# Altium schematic sheet MARS_GPIO_MISC.SchDoc: My title
size A3; Organization: University of California; Address1: 475 Portola Plaza; Address2: Los Angeles, CA 90095; Revision: R01; SheetNumber: 1; SheetTotal: 1
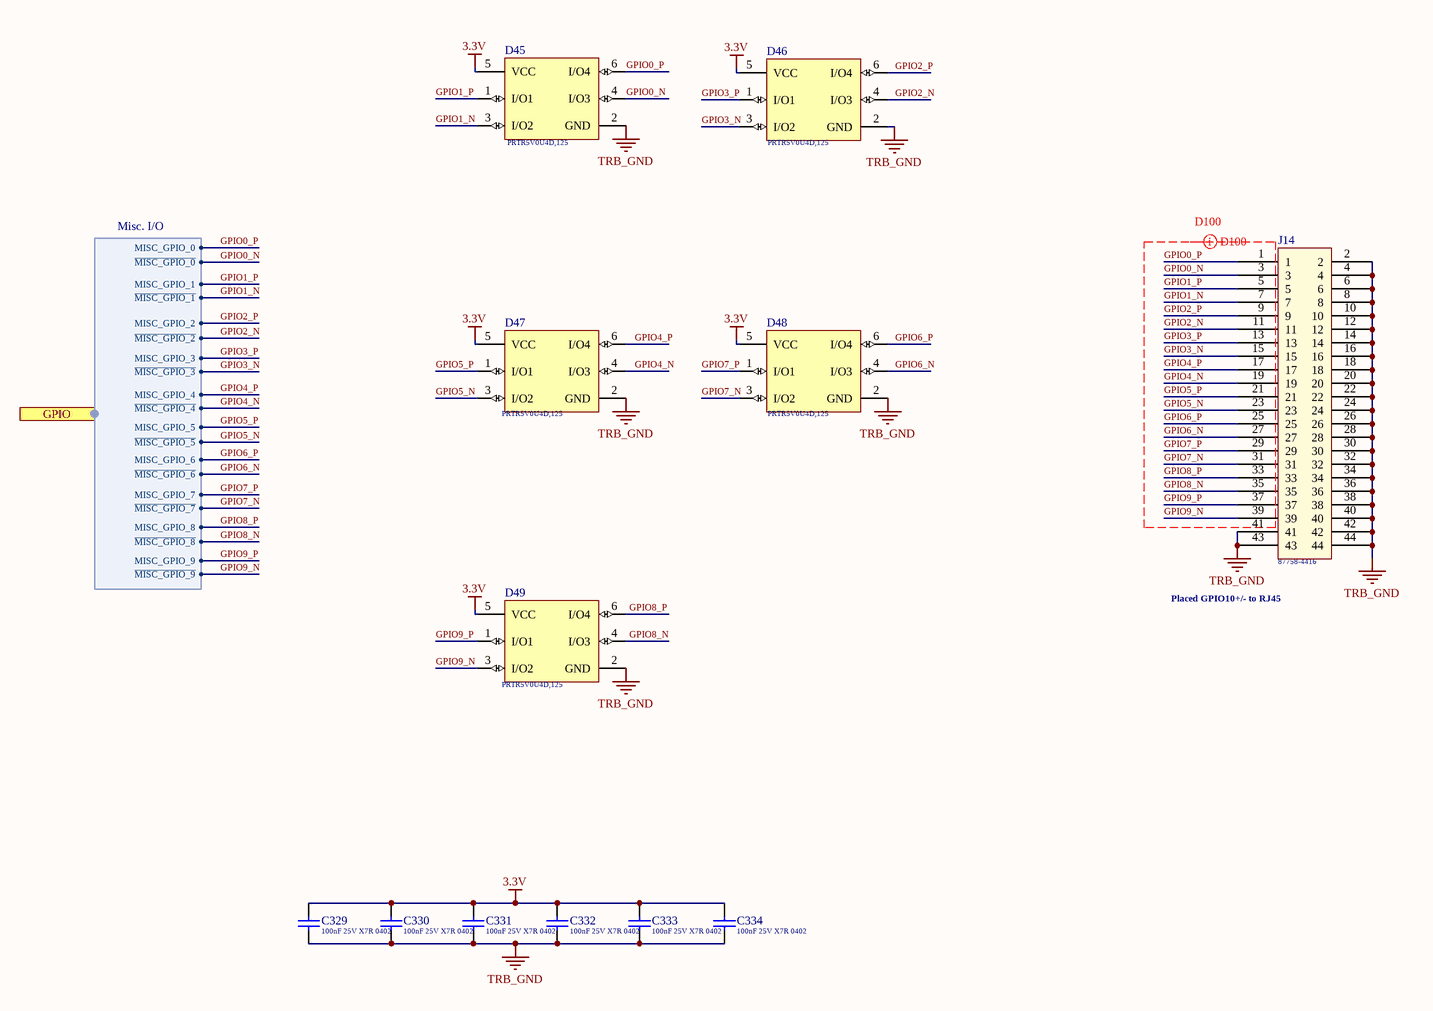
[diagram p0: MARS_GPIO_MISC.SchDoc]

## Parts
C329  Capacitance: 100nF 25V X7R 0402  [Cap_Taiyo_Yuden_TMK105B7104KV-FR_100nF]  (hidden comment: Cap_Taiyo_Yuden_TMK105B7104KV-FR_100nF)
C330  Capacitance: 100nF 25V X7R 0402  [Cap_Taiyo_Yuden_TMK105B7104KV-FR_100nF]  (hidden comment: Cap_Taiyo_Yuden_TMK105B7104KV-FR_100nF)
C331  Capacitance: 100nF 25V X7R 0402  [Cap_Taiyo_Yuden_TMK105B7104KV-FR_100nF]  (hidden comment: Cap_Taiyo_Yuden_TMK105B7104KV-FR_100nF)
C332  Capacitance: 100nF 25V X7R 0402  [Cap_Taiyo_Yuden_TMK105B7104KV-FR_100nF]  (hidden comment: Cap_Taiyo_Yuden_TMK105B7104KV-FR_100nF)
C333  Capacitance: 100nF 25V X7R 0402  [Cap_Taiyo_Yuden_TMK105B7104KV-FR_100nF]  (hidden comment: Cap_Taiyo_Yuden_TMK105B7104KV-FR_100nF)
C334  Capacitance: 100nF 25V X7R 0402  [Cap_Taiyo_Yuden_TMK105B7104KV-FR_100nF]  (hidden comment: Cap_Taiyo_Yuden_TMK105B7104KV-FR_100nF)
D45  PRTR5V0U4D,125  [PRTR5V0U4D,125]
D46  PRTR5V0U4D,125  [PRTR5V0U4D,125]
D47  PRTR5V0U4D,125  [PRTR5V0U4D,125]
D48  PRTR5V0U4D,125  [PRTR5V0U4D,125]
D49  PRTR5V0U4D,125  [PRTR5V0U4D,125]
J14  Series: 87758-4416  [Header_Molex_87758-4416_44POS]  (hidden comment: Header_Molex_87758-4416_44POS)

## Ports
GPIO (harness Misc. I/O)

## Harnesses
Misc. I/O: MISC_GPIO_0, ~{MISC_GPIO_0}, MISC_GPIO_1, ~{MISC_GPIO_1}, MISC_GPIO_2, ~{MISC_GPIO_2}, MISC_GPIO_3, ~{MISC_GPIO_3}, MISC_GPIO_4, ~{MISC_GPIO_4}, MISC_GPIO_5, ~{MISC_GPIO_5}, MISC_GPIO_6, ~{MISC_GPIO_6}, MISC_GPIO_7, ~{MISC_GPIO_7}, MISC_GPIO_8, ~{MISC_GPIO_8}, MISC_GPIO_9, ~{MISC_GPIO_9}

## Nets
3.3V: C329.2 C330.2 C331.2 C332.2 C333.2 C334.2 D45.5(VCC) D46.5(VCC) D47.5(VCC) D48.5(VCC) D49.5(VCC)
TRB_GND: C329.1 C330.1 C331.1 C332.1 C333.1 C334.1 D45.2(GND) D46.2(GND) D47.2(GND) D48.2(GND) D49.2(GND) J14.2 J14.4 J14.6 J14.8 J14.10 J14.12 J14.14 J14.16 J14.18 J14.20 J14.22 J14.24 J14.26 J14.28 J14.30 J14.32 J14.34 J14.36 J14.38 J14.40 J14.41 J14.42 J14.43 J14.44
GPIO0_N: D45.4(I/O3) J14.3 ; port GPIO.~{MISC_GPIO_0}
GPIO0_P: D45.6(I/O4) J14.1 ; port GPIO.MISC_GPIO_0
GPIO1_N: D45.3(I/O2) J14.7 ; port GPIO.~{MISC_GPIO_1}
GPIO1_P: D45.1(I/O1) J14.5 ; port GPIO.MISC_GPIO_1
GPIO2_N: D46.4(I/O3) J14.11 ; port GPIO.~{MISC_GPIO_2}
GPIO2_P: D46.6(I/O4) J14.9 ; port GPIO.MISC_GPIO_2
GPIO3_N: D46.3(I/O2) J14.15 ; port GPIO.~{MISC_GPIO_3}
GPIO3_P: D46.1(I/O1) J14.13 ; port GPIO.MISC_GPIO_3
GPIO4_N: D47.4(I/O3) J14.19 ; port GPIO.~{MISC_GPIO_4}
GPIO4_P: D47.6(I/O4) J14.17 ; port GPIO.MISC_GPIO_4
GPIO5_N: D47.3(I/O2) J14.23 ; port GPIO.~{MISC_GPIO_5}
GPIO5_P: D47.1(I/O1) J14.21 ; port GPIO.MISC_GPIO_5
GPIO6_N: D48.4(I/O3) J14.27 ; port GPIO.~{MISC_GPIO_6}
GPIO6_P: D48.6(I/O4) J14.25 ; port GPIO.MISC_GPIO_6
GPIO7_N: D48.3(I/O2) J14.31 ; port GPIO.~{MISC_GPIO_7}
GPIO7_P: D48.1(I/O1) J14.29 ; port GPIO.MISC_GPIO_7
GPIO8_N: D49.4(I/O3) J14.35 ; port GPIO.~{MISC_GPIO_8}
GPIO8_P: D49.6(I/O4) J14.33 ; port GPIO.MISC_GPIO_8
GPIO9_N: D49.3(I/O2) J14.39 ; port GPIO.~{MISC_GPIO_9}
GPIO9_P: D49.1(I/O1) J14.37 ; port GPIO.MISC_GPIO_9

## Layout directives
differential pair; differential pair class D100: GPIO0_N, GPIO0_P, GPIO1_N, GPIO1_P, GPIO2_N, GPIO2_P, GPIO3_N, GPIO3_P, GPIO4_N, GPIO4_P, GPIO5_N, GPIO5_P, GPIO6_N, GPIO6_P, GPIO7_N, GPIO7_P, GPIO8_N, GPIO8_P, GPIO9_N, GPIO9_P

## Notes on the sheet
- D100
- (near J14) Placed GPIO10+/- to RJ45
- 475 Portola Plaza
- GAPS TOF
- igarcia91@g.ucla.edu
- Los Angeles, CA
- 310-825-0344
- Size:
- Date:
- Letter
- Number:
- Time:
- Sheet
- Revision:
- of
- andrew.peck@cern.ch
- spq@ucla.edu
- File:

## Library data of the parts
C329-C334 = Cap_Taiyo_Yuden_TMK105B7104KV-FR_100nF: CAP CER 100nF 25V X7R 0402; Supplier 1: Mouser; Supplier Part Number 1: 963-TMK105B7104KV-FR
D45-D49 = PRTR5V0U4D,125: ESD Suppressors / TVS Diodes 5.5V QUAD R-R ESD ULTRA LOW CAP; Supplier 1: Mouser; Supplier Part Number 1: 771-PRTR5V0U4D-T/R
J14 = Header_Molex_87758-4416_44POS: Headers & Wire Housings VERT HEADER 44P Lead Free; Supplier Part Number 1: 538-87758-4416; Supplier 1: Mouser